# Altium schematic sheet Sheet.SchDoc
size A4; SheetNumber: 1; SheetTotal: 1
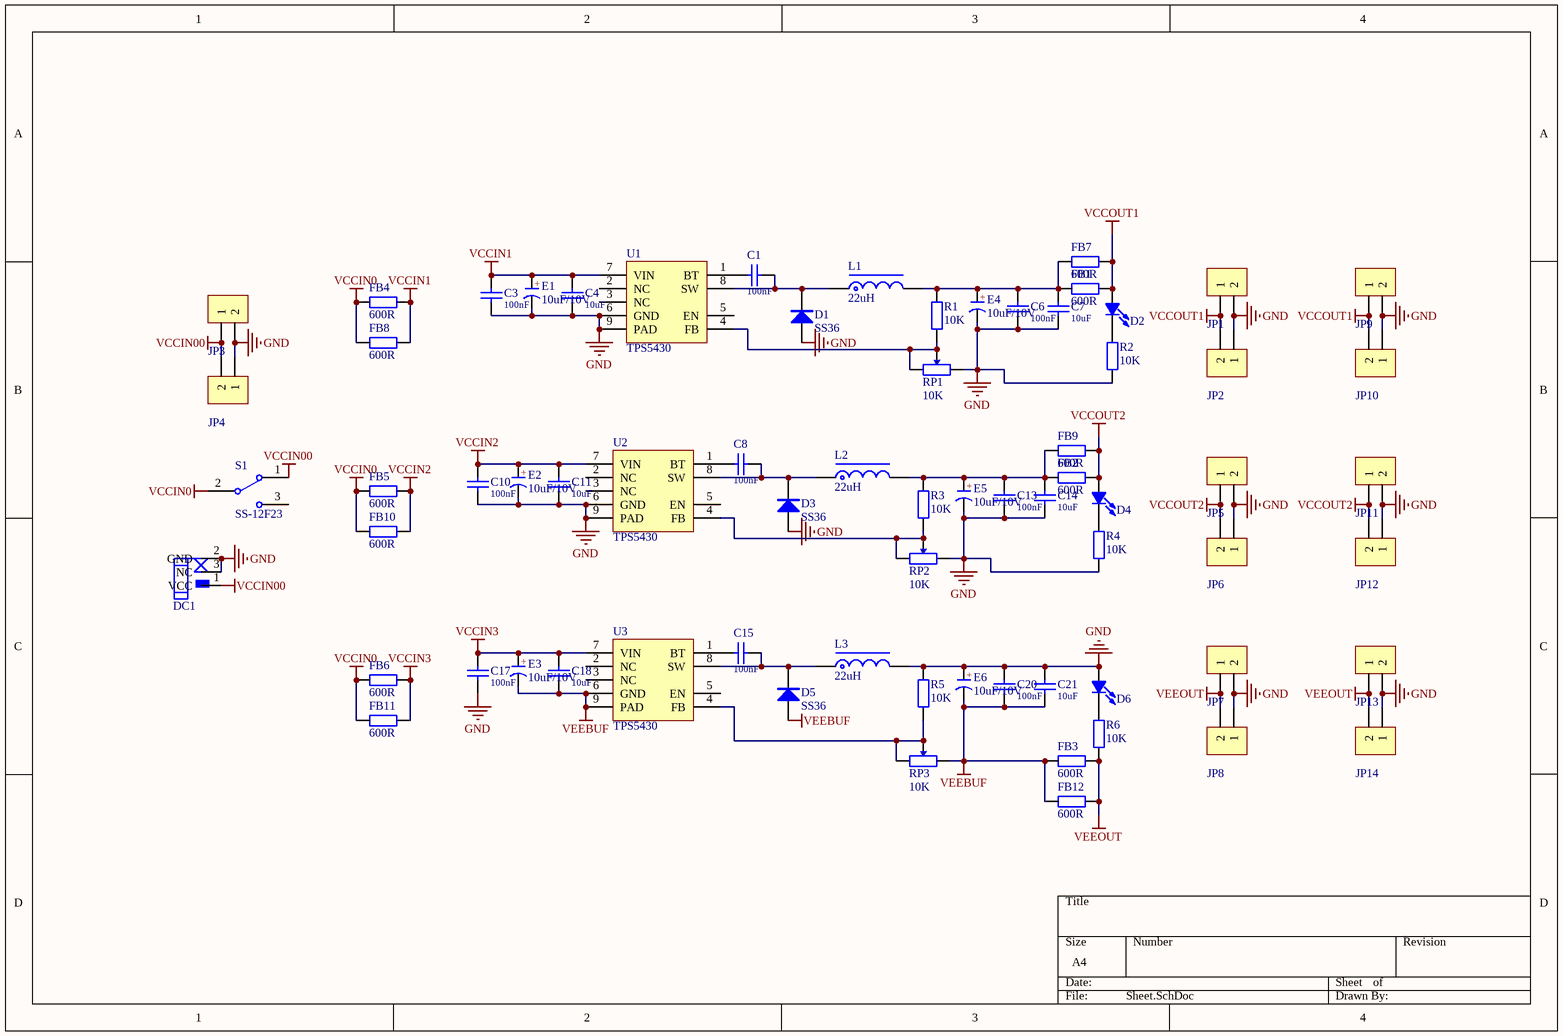
[diagram p0: Sheet.SchDoc]

## Parts
C1  value 100nF  [C0603-L]  (hidden comment: Cap-S)
C3  value 100nF  [C0603-L]  (hidden comment: Cap-S)
C4  value 10uF  [C0603-L]  (hidden comment: Cap-S)
C6  value 100nF  [C0603-L]  (hidden comment: Cap-S)
C7  value 10uF  [C0603-L]  (hidden comment: Cap-S)
C8  value 100nF  [C0603-L]  (hidden comment: Cap-S)
C10  value 100nF  [C0603-L]  (hidden comment: Cap-S)
C11  value 10uF  [C0603-L]  (hidden comment: Cap-S)
C13  value 100nF  [C0603-L]  (hidden comment: Cap-S)
C14  value 10uF  [C0603-L]  (hidden comment: Cap-S)
C15  value 100nF  [C0603-L]  (hidden comment: Cap-S)
C17  value 100nF  [C0603-L]  (hidden comment: Cap-S)
C18  value 10uF  [C0603-L]  (hidden comment: Cap-S)
C20  value 100nF  [C0603-L]  (hidden comment: Cap-S)
C21  value 10uF  [C0603-L]  (hidden comment: Cap-S)
D1  SS36  [SMA]
D2  LED  [Led-0805_L]  (value not drawn)
D3  SS36  [SMA]
D4  LED  [Led-0805_L]  (value not drawn)
D5  SS36  [SMA]
D6  LED  [Led-0805_L]  (value not drawn)
DC1  DC  [DCIN-L]  (value not drawn)
E1  10uF/10V  [CT 6*6 - V]
E2  10uF/10V  [CT 6*6 - V]
E3  10uF/10V  [CT 6*6 - V]
E4  10uF/10V  [CT 6*6 - V]
E5  10uF/10V  [CT 6*6 - V]
E6  10uF/10V  [CT 6*6 - V]
FB1  600R  [FB-0603]
FB2  600R  [FB-0603]
FB3  600R  [FB-0603]
FB4  600R  [FB-0603]
FB5  600R  [FB-0603]
FB6  600R  [FB-0603]
FB7  600R  [FB-0603]
FB8  600R  [FB-0603]
FB9  600R  [FB-0603]
FB10  600R  [FB-0603]
FB11  600R  [FB-0603]
FB12  600R  [FB-0603]
JP1  HDR-1X2  [VH3.96-LI-2P]  (value not drawn)
JP2  HDR-1X2  [VH3.96-LI-2P]  (value not drawn)
JP3  HDR-1X2  [VH3.96-LI-2P]  (value not drawn)
JP4  HDR-1X2  [VH3.96-LI-2P]  (value not drawn)
JP5  HDR-1X2  [VH3.96-LI-2P]  (value not drawn)
JP6  HDR-1X2  [VH3.96-LI-2P]  (value not drawn)
JP7  HDR-1X2  [VH3.96-LI-2P]  (value not drawn)
JP8  HDR-1X2  [VH3.96-LI-2P]  (value not drawn)
JP9  HDR-1X2  [VH3.96-LI-2P]  (value not drawn)
JP10  HDR-1X2  [VH3.96-LI-2P]  (value not drawn)
JP11  HDR-1X2  [VH3.96-LI-2P]  (value not drawn)
JP12  HDR-1X2  [VH3.96-LI-2P]  (value not drawn)
JP13  HDR-1X2  [VH3.96-LI-2P]  (value not drawn)
JP14  HDR-1X2  [VH3.96-LI-2P]  (value not drawn)
L1  22uH  [CDRH73]
L2  22uH  [CDRH73]
L3  22uH  [CDRH73]
R1  10K  [R 0603_L]
R2  10K  [R 0603_L]
R3  10K  [R 0603_L]
R4  10K  [R 0603_L]
R5  10K  [R 0603_L]
R6  10K  [R 0603_L]
RP1  10K  [3296W]
RP2  10K  [3296W]
RP3  10K  [3296W]
S1  SS-12F23  [SS-12D10]
U1  TPS5430  [SOP-8 with pad]
U2  TPS5430  [SOP-8 with pad]
U3  TPS5430  [SOP-8 with pad]

## Nets
GND: C3.1 C4.1 C6.1 C7.1 C10.1 C11.1 C13.1 C14.1 C17.1 C20.2 C21.2 D1.1(A) D3.1(A) D6.1 DC1.2(GND) DC1.3(NC) E1.2(K) E2.2(K) E4.2(K) E5.2(K) E6.1(A) JP1.2 JP2.1 JP3.2 JP4.1 JP5.2 JP6.1 JP7.2 JP8.1 JP9.2 JP10.1 JP11.2 JP12.1 JP13.2 JP14.1 L3.2 R2.1 R4.1 R5.2 RP1.3 RP2.3 U1.6(GND) U1.9(PAD) U2.6(GND) U2.9(PAD)
VCCIN00: DC1.1(VCC) JP3.1 JP4.2 S1.1
VCCIN0: FB4.1 FB5.1 FB6.1 FB8.1 FB10.1 FB11.1 S1.2
VCCIN1: C3.2 C4.2 E1.1(A) FB4.2 FB8.2 U1.7(VIN)
VCCIN2: C10.2 C11.2 E2.1(A) FB5.2 FB10.2 U2.7(VIN)
VCCIN3: C17.2 C18.2 E3.1(A) FB6.2 FB11.2 U3.7(VIN)
VCCOUT1: D2.1 FB1.2 FB7.2 JP1.1 JP2.2 JP9.1 JP10.2
VCCOUT2: D4.1 FB2.2 FB9.2 JP5.1 JP6.2 JP11.1 JP12.2
VEEBUF: C18.1 C20.1 C21.1 D5.1(A) E3.2(K) E6.2(K) FB3.1 FB12.1 RP3.3 U3.6(GND) U3.9(PAD)
VEEOUT: FB3.2 FB12.2 JP7.1 JP8.2 JP13.1 JP14.2 R6.1
NetC1_1: C1.1 U1.1(BT)
NetC1_2: C1.2 D1.2(K) L1.1 U1.8(SW)
NetC6_2: C6.2 C7.2 E4.1(A) FB1.1 FB7.1 L1.2 R1.2
NetC8_1: C8.1 U2.1(BT)
NetC8_2: C8.2 D3.2(K) L2.1 U2.8(SW)
NetC13_2: C13.2 C14.2 E5.1(A) FB2.1 FB9.1 L2.2 R3.2
NetC15_1: C15.1 U3.1(BT)
NetC15_2: C15.2 D5.2(K) L3.1 U3.8(SW)
NetD2_2: D2.2 R2.2
NetD4_2: D4.2 R4.2
NetD6_2: D6.2 R6.2
NetR1_1: R1.1 RP1.1 RP1.2 U1.4(FB)
NetR3_1: R3.1 RP2.1 RP2.2 U2.4(FB)
NetR5_1: R5.1 RP3.1 RP3.2 U3.4(FB)

Not connected (* = marked no-connect by the designer): S1 3; U1 2(NC) 3(NC) 5(EN); U2 2(NC) 3(NC) 5(EN); U3 2(NC) 3(NC) 5(EN)

## Notes on the sheet
- (in symbol C-CT) +

## Library data of the parts
C1 C3 C4 C6-C8 C10 C11 C13-C15 C17 C18 C20 C21 = Cap-S: 贴片瓷片电容
D1 D3 D5 = M7: 整流二极管; 版权归属: 源创客; BOM名称: 整流二极管; 学习资源: www.ooocke.com
D2 D4 D6 = LED: 发光二极管
DC1 = DC: DC插座
E1-E6 = C-CT: 贴片固态电容; 版权归属: 源创客; BOM名称: 贴片固态电容; 学习资源: www.ooocke.com
FB1-FB12 = FB
JP1-JP14 = Header 2_1: 2P接插件; 版权归属: 源创客; BOM名称: 2P接插件; 学习资源: www.ooocke.com
L1-L3 = L-CDRH: 功率屏蔽电感; 版权归属: 源创客; BOM名称: 功率屏蔽电感; 学习资源: www.ooocke.com
R1-R6 = R: 贴片电阻; 版权归属: 源创客; BOM名称: 贴片电阻; 学习资源: www.ooocke.com
RP1-RP3 = RP-ID: 插件单联电位器; BOM名称: 插件电位器; 版权归属: 源创客; 学习资源: www.ooocke.com
S1 = SSW-1P: 1路波动开关; BOM名称: 波动开关; 版权归属: 源创客; 学习资源: www.ooocke.com